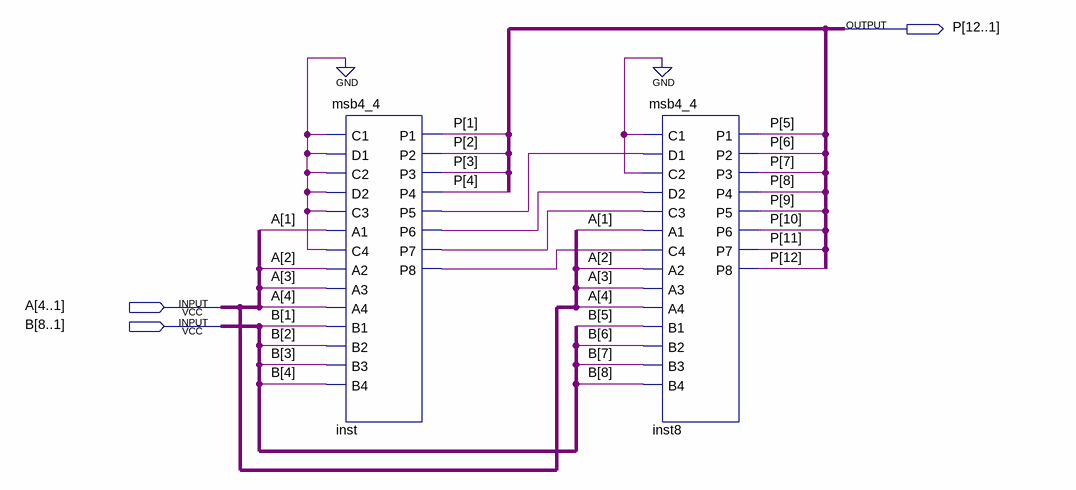
[diagram p0: schematic sheet]
// Quartus schematic MSB4_8.bdf as structural Verilog: 2 symbols, 3 pins
module MSB4_8 (
  input  [4:1] A,
  input  [8:1] B,
  output [12:1] P
);

  wire inst_p5, inst_p6, inst_p7, inst_p8;

  msb4_4 inst (
    .C1(1'b0), .D1(1'b0), .C2(1'b0), .D2(1'b0), .C3(1'b0), .A1(A[1]), .C4(1'b0), .A2(A[2]), .A3(A[3]),
    .A4(A[4]), .B1(B[1]), .B2(B[2]), .B3(B[3]), .B4(B[4]), .P1(P[1]), .P2(P[2]), .P3(P[3]), .P4(P[4]),
    .P5(inst_p5), .P6(inst_p6), .P7(inst_p7), .P8(inst_p8));
  msb4_4 inst8 (
    .C1(1'b0), .D1(inst_p5), .C2(1'b0), .D2(inst_p6), .C3(inst_p7), .A1(A[1]), .C4(inst_p8), .A2(A[2]),
    .A3(A[3]), .A4(A[4]), .B1(B[5]), .B2(B[6]), .B3(B[7]), .B4(B[8]), .P1(P[5]), .P2(P[6]), .P3(P[7]),
    .P4(P[8]), .P5(P[9]), .P6(P[10]), .P7(P[11]), .P8(P[12]));
endmodule
